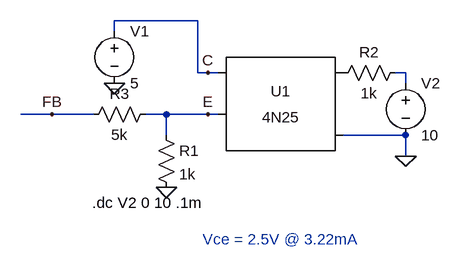
[diagram p0: schematic sch.asc]
sch.asc, the LTspice schematic file:
Version 4
SHEET 1 880 680
WIRE 32 32 -96 32
WIRE -96 48 -96 32
WIRE 32 112 32 32
WIRE 48 112 32 112
WIRE 64 112 48 112
WIRE 352 112 336 112
WIRE 352 128 352 112
WIRE -192 176 -240 176
WIRE -128 176 -192 176
WIRE -16 176 -48 176
WIRE 48 176 -16 176
WIRE 64 176 48 176
WIRE -16 208 -16 176
WIRE 352 208 256 208
WIRE 352 240 352 208
FLAG 352 240 0
FLAG -96 128 0
FLAG -16 288 0
FLAG -192 176 FB
FLAG 48 112 C
FLAG 48 176 E
SYMBOL Optos\\4N25 160 176 M0
SYMATTR InstName U1
SYMBOL voltage -96 32 R0
WINDOW 123 0 0 Left 0
WINDOW 39 0 0 Left 0
SYMATTR InstName V1
SYMATTR Value 5
SYMBOL res -32 192 R0
SYMATTR InstName R1
SYMATTR Value 1k
SYMBOL res 352 96 R90
WINDOW 0 0 56 VBottom 2
WINDOW 3 32 56 VTop 2
SYMATTR InstName R2
SYMATTR Value 1k
SYMBOL voltage 352 112 R0
WINDOW 123 0 0 Left 0
WINDOW 39 0 0 Left 0
SYMATTR InstName V2
SYMATTR Value 10
SYMBOL res -32 160 R90
WINDOW 0 0 56 VBottom 2
WINDOW 3 32 56 VTop 2
SYMATTR InstName R3
SYMATTR Value 5k
TEXT -130 312 Left 2 !.dc V2 0 10 .1m
TEXT 40 368 Left 2 ;Vce = 2.5V @ 3.22mA

The netlist it stands for:
* sch.asc
XU1 P001 0 C E NC_01 4N25
V1 C 0 5
R1 E 0 1k
R2 N001 P001 1k
V2 N001 0 10
R3 E FB 5k
.dc V2 0 10 .1m
* Vce = 2.5V @ 3.22mA
.lib 4N25.sub
.backanno
.end